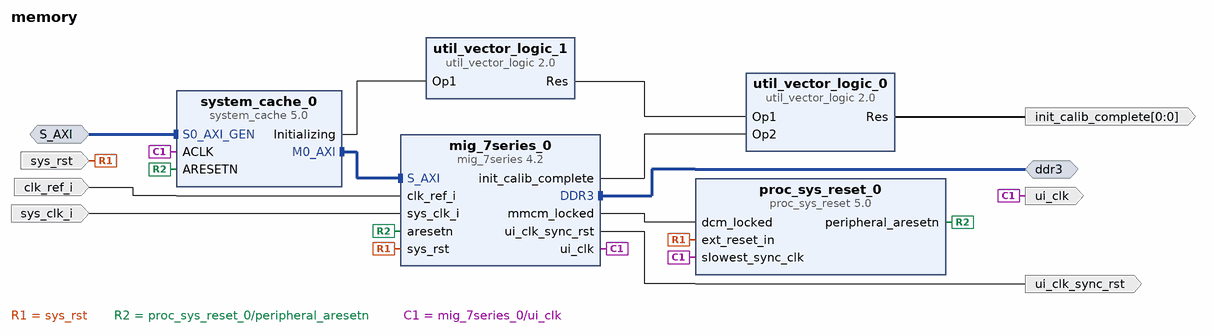
[diagram p0: block diagram of the top level]
# Vivado block design memory, xc7a100tcsg324-1, Vivado 2020.1
create_bd_design memory

create_bd_intf_port -mode Master -vlnv xilinx.com:interface:ddrx_rtl:1.0 ddr3
create_bd_intf_port -mode Slave -vlnv xilinx.com:interface:aximm_rtl:1.0 S_AXI
set_property -dict [list \
  CONFIG.DATA_WIDTH 32 \
  CONFIG.PROTOCOL AXI4 \
  CONFIG.FREQ_HZ 83333333 \
  CONFIG.ID_WIDTH 1 \
  CONFIG.ADDR_WIDTH 32 \
  CONFIG.AWUSER_WIDTH 32 \
  CONFIG.ARUSER_WIDTH 32 \
  CONFIG.WUSER_WIDTH 0 \
  CONFIG.RUSER_WIDTH 0 \
  CONFIG.BUSER_WIDTH 0 \
  CONFIG.READ_WRITE_MODE READ_WRITE \
  CONFIG.HAS_BURST 1 \
  CONFIG.HAS_LOCK 1 \
  CONFIG.HAS_PROT 1 \
  CONFIG.HAS_CACHE 1 \
  CONFIG.HAS_QOS 1 \
  CONFIG.HAS_REGION 0 \
  CONFIG.HAS_WSTRB 1 \
  CONFIG.HAS_BRESP 1 \
  CONFIG.HAS_RRESP 1 \
  CONFIG.SUPPORTS_NARROW_BURST 1 \
  CONFIG.NUM_READ_OUTSTANDING 2 \
  CONFIG.NUM_WRITE_OUTSTANDING 2 \
  CONFIG.MAX_BURST_LENGTH 256 \
  CONFIG.NUM_READ_THREADS 1 \
  CONFIG.NUM_WRITE_THREADS 1 \
  CONFIG.RUSER_BITS_PER_BYTE 0 \
  CONFIG.WUSER_BITS_PER_BYTE 0 \
] [get_bd_intf_ports S_AXI]
create_bd_port -dir I -type clk clk_ref_i
create_bd_port -dir I -type clk sys_clk_i
create_bd_port -dir I -type rst sys_rst
create_bd_port -dir O -from 0 -to 0 init_calib_complete
create_bd_port -dir O -type clk ui_clk
set_property -dict {CONFIG.ASSOCIATED_BUSIF S_AXI CONFIG.FREQ_HZ 83333333} [get_bd_ports ui_clk]
create_bd_port -dir O -type rst ui_clk_sync_rst

create_bd_cell -type ip -vlnv xilinx.com:ip:proc_sys_reset:5.0 proc_sys_reset_0
create_bd_cell -type ip -vlnv xilinx.com:ip:system_cache:5.0 system_cache_0
set_property -dict [list \
  CONFIG.C_CACHE_DATA_MEMORY_TYPE 2 \
  CONFIG.C_CACHE_LRU_MEMORY_TYPE 2 \
  CONFIG.C_CACHE_SIZE 262144 \
  CONFIG.C_CACHE_TAG_MEMORY_TYPE 2 \
  CONFIG.C_ENABLE_MASTER_COHERENCY 0 \
  CONFIG.C_ENABLE_SLAVE_COHERENCY 0 \
  CONFIG.C_NUM_GENERIC_PORTS 1 \
  CONFIG.C_NUM_OPTIMIZED_PORTS 0 \
] [get_bd_cells system_cache_0]
create_bd_cell -type ip -vlnv xilinx.com:ip:util_vector_logic:2.0 util_vector_logic_0
set_property -dict {CONFIG.C_SIZE 1} [get_bd_cells util_vector_logic_0]
create_bd_cell -type ip -vlnv xilinx.com:ip:util_vector_logic:2.0 util_vector_logic_1
set_property -dict {CONFIG.C_OPERATION not CONFIG.C_SIZE 1} [get_bd_cells util_vector_logic_1]
create_bd_cell -type ip -vlnv xilinx.com:ip:mig_7series:4.2 mig_7series_0
set_property -dict [list \
  CONFIG.BOARD_MIG_PARAM Custom \
  CONFIG.RESET_BOARD_INTERFACE Custom \
  CONFIG.XML_INPUT_FILE mig_b.prj \
] [get_bd_cells mig_7series_0]

# ---- connections ----

connect_bd_intf_net -intf_net S0_AXI_GEN_0_1 [get_bd_intf_ports S_AXI] [get_bd_intf_pins system_cache_0/S0_AXI_GEN]
connect_bd_intf_net [get_bd_intf_ports ddr3] [get_bd_intf_pins mig_7series_0/DDR3]
connect_bd_intf_net [get_bd_intf_pins system_cache_0/M0_AXI] [get_bd_intf_pins mig_7series_0/S_AXI]
connect_bd_net -net sys_rst_0_1 [get_bd_ports sys_rst] [get_bd_pins proc_sys_reset_0/ext_reset_in] [get_bd_pins mig_7series_0/sys_rst]
connect_bd_net [get_bd_pins proc_sys_reset_0/peripheral_aresetn] [get_bd_pins system_cache_0/ARESETN] [get_bd_pins mig_7series_0/aresetn]
connect_bd_net [get_bd_pins util_vector_logic_0/Res] [get_bd_ports init_calib_complete]
connect_bd_net [get_bd_pins mig_7series_0/ui_clk] \
  [get_bd_ports ui_clk] [get_bd_pins proc_sys_reset_0/slowest_sync_clk] [get_bd_pins system_cache_0/ACLK]
connect_bd_net [get_bd_pins system_cache_0/Initializing] [get_bd_pins util_vector_logic_1/Op1]
connect_bd_net [get_bd_pins util_vector_logic_1/Res] [get_bd_pins util_vector_logic_0/Op1]
connect_bd_net [get_bd_pins mig_7series_0/ui_clk_sync_rst] [get_bd_ports ui_clk_sync_rst]
connect_bd_net [get_bd_pins mig_7series_0/mmcm_locked] [get_bd_pins proc_sys_reset_0/dcm_locked]
connect_bd_net [get_bd_pins mig_7series_0/init_calib_complete] [get_bd_pins util_vector_logic_0/Op2]
connect_bd_net [get_bd_ports clk_ref_i] [get_bd_pins mig_7series_0/clk_ref_i]
connect_bd_net [get_bd_ports sys_clk_i] [get_bd_pins mig_7series_0/sys_clk_i]

# ---- address map ----
exclude_bd_addr_seg -offset 0x80000000 -range 256M -target_address_space [get_bd_addr_spaces S_AXI] [get_bd_addr_segs mig_7series_0/memmap/memaddr]

validate_bd_design
save_bd_design
